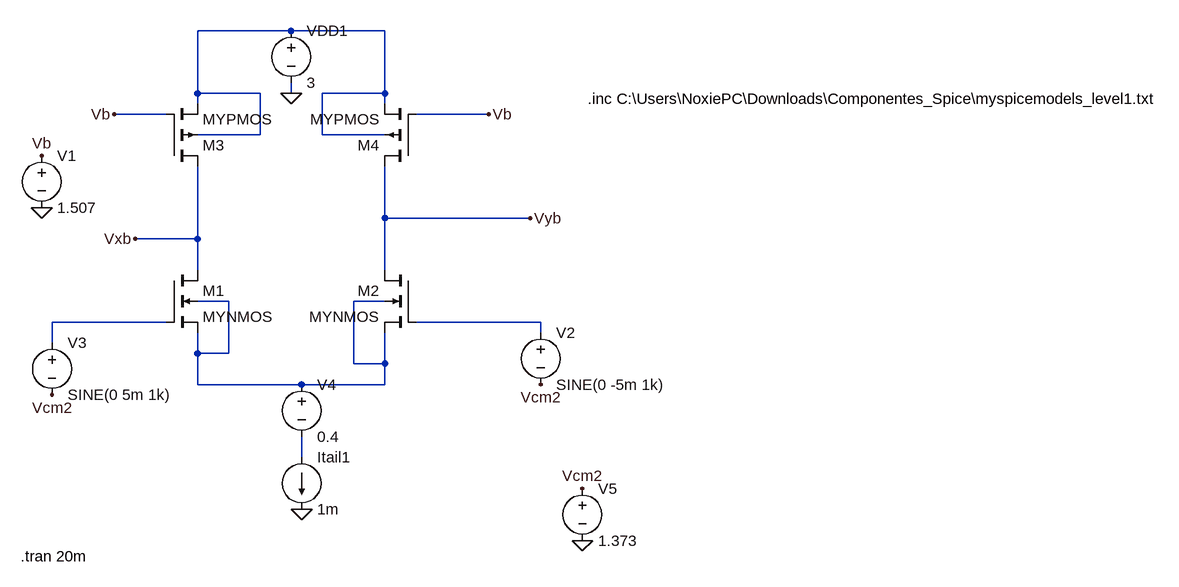
[diagram p0: schematic DiferencialConFuenteDeCorriente.asc]
DiferencialConFuenteDeCorriente.asc, the LTspice schematic file:
Version 4.1
SHEET 1 1736 680
WIRE 176 -240 32 -240
WIRE 320 -240 176 -240
WIRE 32 -144 32 -240
WIRE 128 -144 32 -144
WIRE 176 -144 176 -160
WIRE 320 -144 320 -240
WIRE 320 -144 224 -144
WIRE 32 -128 32 -144
WIRE 320 -128 320 -144
WIRE -16 -112 -96 -112
WIRE 480 -112 368 -112
WIRE 128 -80 128 -144
WIRE 128 -80 32 -80
WIRE 224 -80 224 -144
WIRE 320 -80 224 -80
WIRE 320 48 320 -32
WIRE 544 48 320 48
WIRE 32 80 32 -32
WIRE 32 80 -64 80
WIRE 32 128 32 80
WIRE 320 128 320 48
WIRE 80 176 32 176
WIRE 320 176 272 176
WIRE -16 208 -192 208
WIRE 560 208 368 208
WIRE 560 224 560 208
WIRE -192 240 -192 208
WIRE 32 256 32 224
WIRE 80 256 80 176
WIRE 80 256 32 256
WIRE 272 272 272 176
WIRE 320 272 320 224
WIRE 320 272 272 272
WIRE 32 304 32 256
WIRE 192 304 32 304
WIRE 320 304 320 272
WIRE 320 304 192 304
WIRE 192 416 192 384
FLAG 192 496 0
FLAG 176 -144 0
FLAG -208 -48 Vb
FLAG -208 32 0
FLAG -64 80 Vxb
FLAG -96 -112 Vb
FLAG 480 -112 Vb
FLAG 544 48 Vyb
FLAG 624 544 0
FLAG 624 464 Vcm2
FLAG 560 304 Vcm2
FLAG -192 320 Vcm2
SYMBOL current 192 416 R0
WINDOW 123 0 0 Left 0
WINDOW 39 0 0 Left 0
SYMATTR InstName Itail1
SYMATTR Value 1m
SYMBOL nmos4 -16 128 R0
SYMATTR InstName M1
SYMATTR Value MYNMOS
SYMATTR Value2 l=0.5u w=50u
SYMBOL nmos4 368 128 M0
SYMATTR InstName M2
SYMATTR Value MYNMOS
SYMATTR Value2 l=0.5u w=50u
SYMBOL voltage 176 -256 R0
WINDOW 123 0 0 Left 0
WINDOW 39 0 0 Left 0
SYMATTR InstName VDD1
SYMATTR Value 3
SYMBOL voltage -208 -64 R0
WINDOW 123 0 0 Left 0
WINDOW 39 0 0 Left 0
SYMATTR InstName V1
SYMATTR Value 1.507
SYMBOL voltage 560 208 R0
WINDOW 123 0 0 Left 0
WINDOW 39 0 0 Left 0
SYMATTR InstName V2
SYMATTR Value SINE(0 -5m 1k)
SYMBOL voltage -192 224 R0
WINDOW 123 0 0 Left 0
WINDOW 39 0 0 Left 0
SYMATTR InstName V3
SYMATTR Value SINE(0 5m 1k)
SYMBOL pmos4 -16 -32 M180
SYMATTR InstName M3
SYMATTR Value MYPMOS
SYMATTR Value2 l=1u w=50u
SYMBOL voltage 192 288 R0
WINDOW 123 0 0 Left 0
WINDOW 39 0 0 Left 0
SYMATTR InstName V4
SYMATTR Value 0.4
SYMBOL pmos4 368 -32 R180
SYMATTR InstName M4
SYMATTR Value MYPMOS
SYMATTR Value2 l=1u w=50u
SYMBOL voltage 624 448 R0
WINDOW 123 0 0 Left 0
WINDOW 39 0 0 Left 0
SYMATTR InstName V5
SYMATTR Value 1.373
TEXT -240 568 Left 2 !.tran 20m
TEXT 632 -136 Left 2 !.inc C:\\Users\\NoxiePC\\Downloads\\Componentes_Spice\\myspicemodels_level1.txt

The netlist it stands for:
* DiferencialConFuenteDeCorriente.asc
Itail1 N005 0 1m
M1 Vxb N003 N002 N002 MYNMOS l=0.5u w=50u
M2 Vyb N004 N002 N002 MYNMOS l=0.5u w=50u
VDD1 N001 0 3
V1 Vb 0 1.507
V2 N004 Vcm2 SINE(0 -5m 1k)
V3 N003 Vcm2 SINE(0 5m 1k)
M3 Vxb Vb N001 N001 MYPMOS l=1u w=50u
V4 N002 N005 0.4
M4 Vyb Vb N001 N001 MYPMOS l=1u w=50u
V5 Vcm2 0 1.373
.model NMOS NMOS
.model PMOS PMOS
.lib standard.mos
.tran 20m
.inc C:\Users\NoxiePC\Downloads\Componentes_Spice\myspicemodels_level1.txt
.backanno
.end